# Altium schematic sheet fab.SchDoc
size A
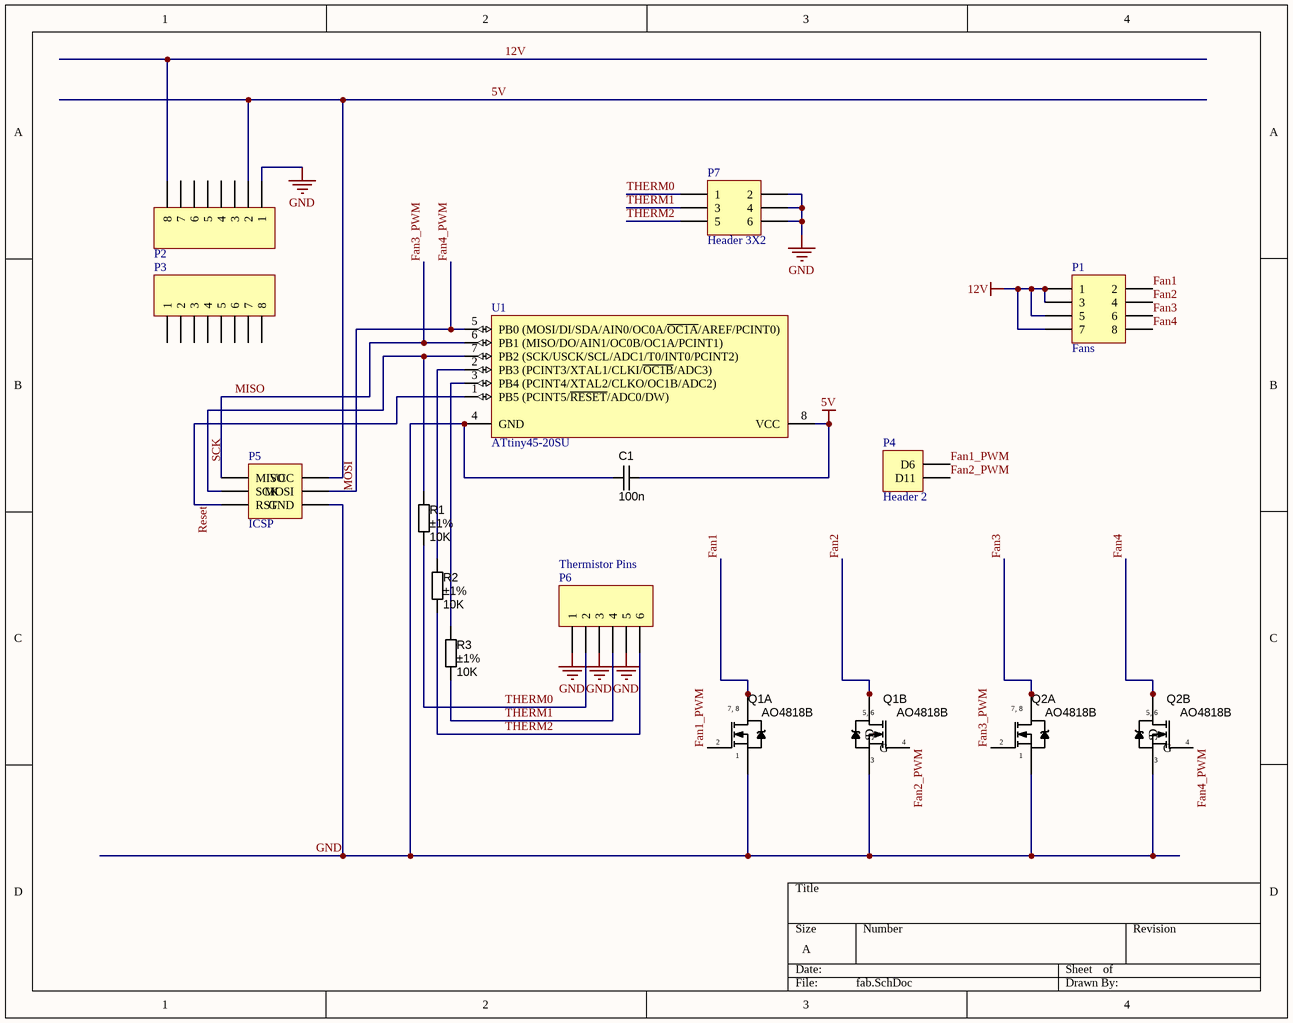
[diagram p0: fab.SchDoc]

## Parts
C1  100n  [CAPC1005X55N]
P1  Fans  [HDR2X4]
P2  Header 8  [HDR1X8]  (value not drawn)
P3  Header 8  [HDR1X8]  (value not drawn)
P4  Header 2  [HDR1X2]
P5  ICSP  [ICSP Pads - SMD]
P6  Thermistor Pins  [HDR1X6]
P7  Header 3X2  [HDR2X3]
Q1  Manufacturer Part Number 1: AO4818B  [SOIC127P600X175-8AN]  (hidden comment: MOSFET_AO4818B)  (parts A,B of 2)
Q2  Manufacturer Part Number 1: AO4818B  [SOIC127P600X175-8AN]  (hidden comment: MOSFET_AO4818B)  (parts A,B of 2)
R1  value 10K  Tolerance: ±1%  [RESC1608X55N]  (hidden comment: Thick Film)
R2  value 10K  Tolerance: ±1%  [RESC1608X55N]  (hidden comment: Thick Film)
R3  value 10K  Tolerance: ±1%  [RESC1608X55N]  (hidden comment: Thick Film)
U1  ATtiny45-20SU  [8S2_N]

## Nets
5V: C1.2 P2.2 P5.1(VCC) U1.8(VCC)
12V: P1.1 P1.3 P1.5 P1.7 P2.8
GND: C1.1 P2.1 P5.5(GND) P6.1 P6.3 P6.5 P7.2 P7.4 P7.6 Q1.1(S) Q1.3(S) Q2.1(S) Q2.3(S) U1.4(GND)
Fan1: P1.2 Q1.7(D) Q1.8(D)
Fan1_PWM: P4.2(D6) Q1.2(G)
Fan2: P1.4 Q1.5(D) Q1.6(D)
Fan2_PWM: P4.1(D11) Q1.4(G)
Fan3: P1.6 Q2.7(D) Q2.8(D)
Fan3_PWM: P5.0(MISO) Q2.2(G) U1.6(PB1_(MISO/DO/AIN1/OC0B/OC1A/PCINT1))  [also labelled MISO]
Fan4: P1.8 Q2.5(D) Q2.6(D)
Fan4_PWM: P5.3(MOSI) Q2.4(G) U1.5(PB0_(MOSI/DI/SDA/AIN0/OC0A/~{OC1A}/AREF/PCINT0))  [also labelled MOSI]
Reset: P5.4(RST) U1.1(PB5_(PCINT5/~{RESET}/ADC0/DW))
SCK: P5.2(SCK) R1.1 U1.7(PB2_(SCK/USCK/SCL/ADC1/T0/INT0/PCINT2))
THERM0: P6.2 P7.1 R1.2
THERM1: P6.4 P7.3 R3.2
THERM2: P6.6 P7.5 R2.2
NetR2_1: R2.1 U1.2(PB3_(PCINT3/XTAL1/CLKI/~{OC1B}/ADC3))
NetR3_1: R3.1 U1.3(PB4_(PCINT4/XTAL2/CLKO/OC1B/ADC2))

Not connected (* = marked no-connect by the designer): P2 3 4 5 6 7; P3 1 2 3 4 5 6 7 8

## Notes on the sheet
- (in symbol MOSFET_AO4818B, part A) 7, 8
- (in symbol MOSFET_AO4818B, part B) 5, 6

## Library data of the parts
C1 = CAPC_100n_0402_X5R_16V_10%: Capacitor SMD Cer 100nF 10% 16V X5R 0402; Manufacturer 1: AVX Corporation; Manufacturer Part Number 1: 0402YD104KAT2A; Ratings: 16V; X5R; SCDType: spec; Tolerance: ±10%; Operating Temperature: -55°C ~ 125°C; Package / Case: 0402 (1005 Metric); Size / Dimension: 0.039" L x 0.020" W (1.00mm x 0.50mm); Supplier 1: Digi-Key; Supplier Part Number 1: 478-1126-1-ND; ComponentLink1URL: http://www.avx.com/docs/Catalogs/cx5r.pdf; ComponentLink1Description: http://www.avx.com/docs/Catalogs/cx5r.pdf; Supplier 2: Digi-Key; Supplier Part Number 2: 311-1347-1-ND; Manufacturer 2: Yageo; Manufacturer Part Number 2: CC0402KRX5R7BB104; ComponentLink2URL: http://www.yageo.com/documents/recent/UPY-GPHC_X5R_4V-to-50V_12.pdf; ComponentLink2Description: http://www.yageo.com/documents/recent/UPY-GPHC_X5R_4V-to-50V_12.pdf; Value: 100n; Supplier: http://au.rs-online.com/web/p/ceramic-multilayer-capacitors/6983197/
P1 = Header 4X2: Header, 4-Pin, Dual row; LatestRevisionDate: 17-Jul-2002; LatestRevisionNote: Re-released for DXP Platform.; Publisher: Altium Limited
P2 P3 = Header 8: Header, 8-Pin; LatestRevisionDate: 17-Jul-2002; LatestRevisionNote: Re-released for DXP Platform.; Publisher: Altium Limited
P4 = Header 2: Header, 2-Pin; LatestRevisionDate: 17-Jul-2002; LatestRevisionNote: Re-released for DXP Platform.; Publisher: Altium Limited
P5 P7 = Header 3X2: Header, 3-Pin, Dual row; LatestRevisionDate: 17-Jul-2002; LatestRevisionNote: Re-released for DXP Platform.; Publisher: Altium Limited
P6 = Header 6: Header, 6-Pin; LatestRevisionDate: 17-Jul-2002; LatestRevisionNote: Re-released for DXP Platform.; Publisher: Altium Limited
Q1 Q2 = MOSFET_AO4818B: MOSFET Dual-Channel 30V 8.5A SOIC-8 SMD; Manufacturer 1: Alpha & Omega Semiconductor Inc; Ratings: 2W; 30V; 8.5A; 16 mOhm; Material: Silicon; SCDType: source; Package / Case: SOIC-8; Supplier 1: Digi-Key; Supplier Part Number 1: 785-1059-1-ND
R1-R3 = RES_10K_0603_1%: Resistor SMD chip 10k Ohm 0.1W 1% 0603; Manufacturer 1: Yageo; Manufacturer Part Number 1: RC0603FR-0710KL; Ratings: 1/10W; SCDType: spec; Package / Case: 0603 (1608 Metric); Supplier 1: Digi-Key; Supplier Part Number 1: 311-10.0KHRCT-ND
U1 = ATtiny45-20SU: 8-bit AVR Microcontroller, 20MHz, 2.7-5.5V, 4K Flash, 256 Bytes EEPROM, 256 Bytes SRAM, Industrial Grade (-40°C to 85°C), 8-Lead SOIC, Pb-Free; DatasheetVersion: revN, Apr-2011; PackageVersion: revF, Apr-2008; PackageReference: 8S2; PackageDescription: 8-Lead, 0.208" Body, Plastic Small Outline Package (EIAJ); ComponentLink1Description: Manufacturer URL; ComponentLink1URL: http://www.atmel.com/; ComponentLink2Description: ATtiny25/45/85 Datasheet; ComponentLink2URL: http://www.atmel.com/dyn/resources/prod_documents/doc2586.pdf; ComponentLink3Description: ATtiny25/45/85 Summary; ComponentLink3URL: http://www.atmel.com/dyn/resources/prod_documents/2586S.pdf